# EAGLE schematic Leuchtali_Schematic (EAGLE 6.5.0)
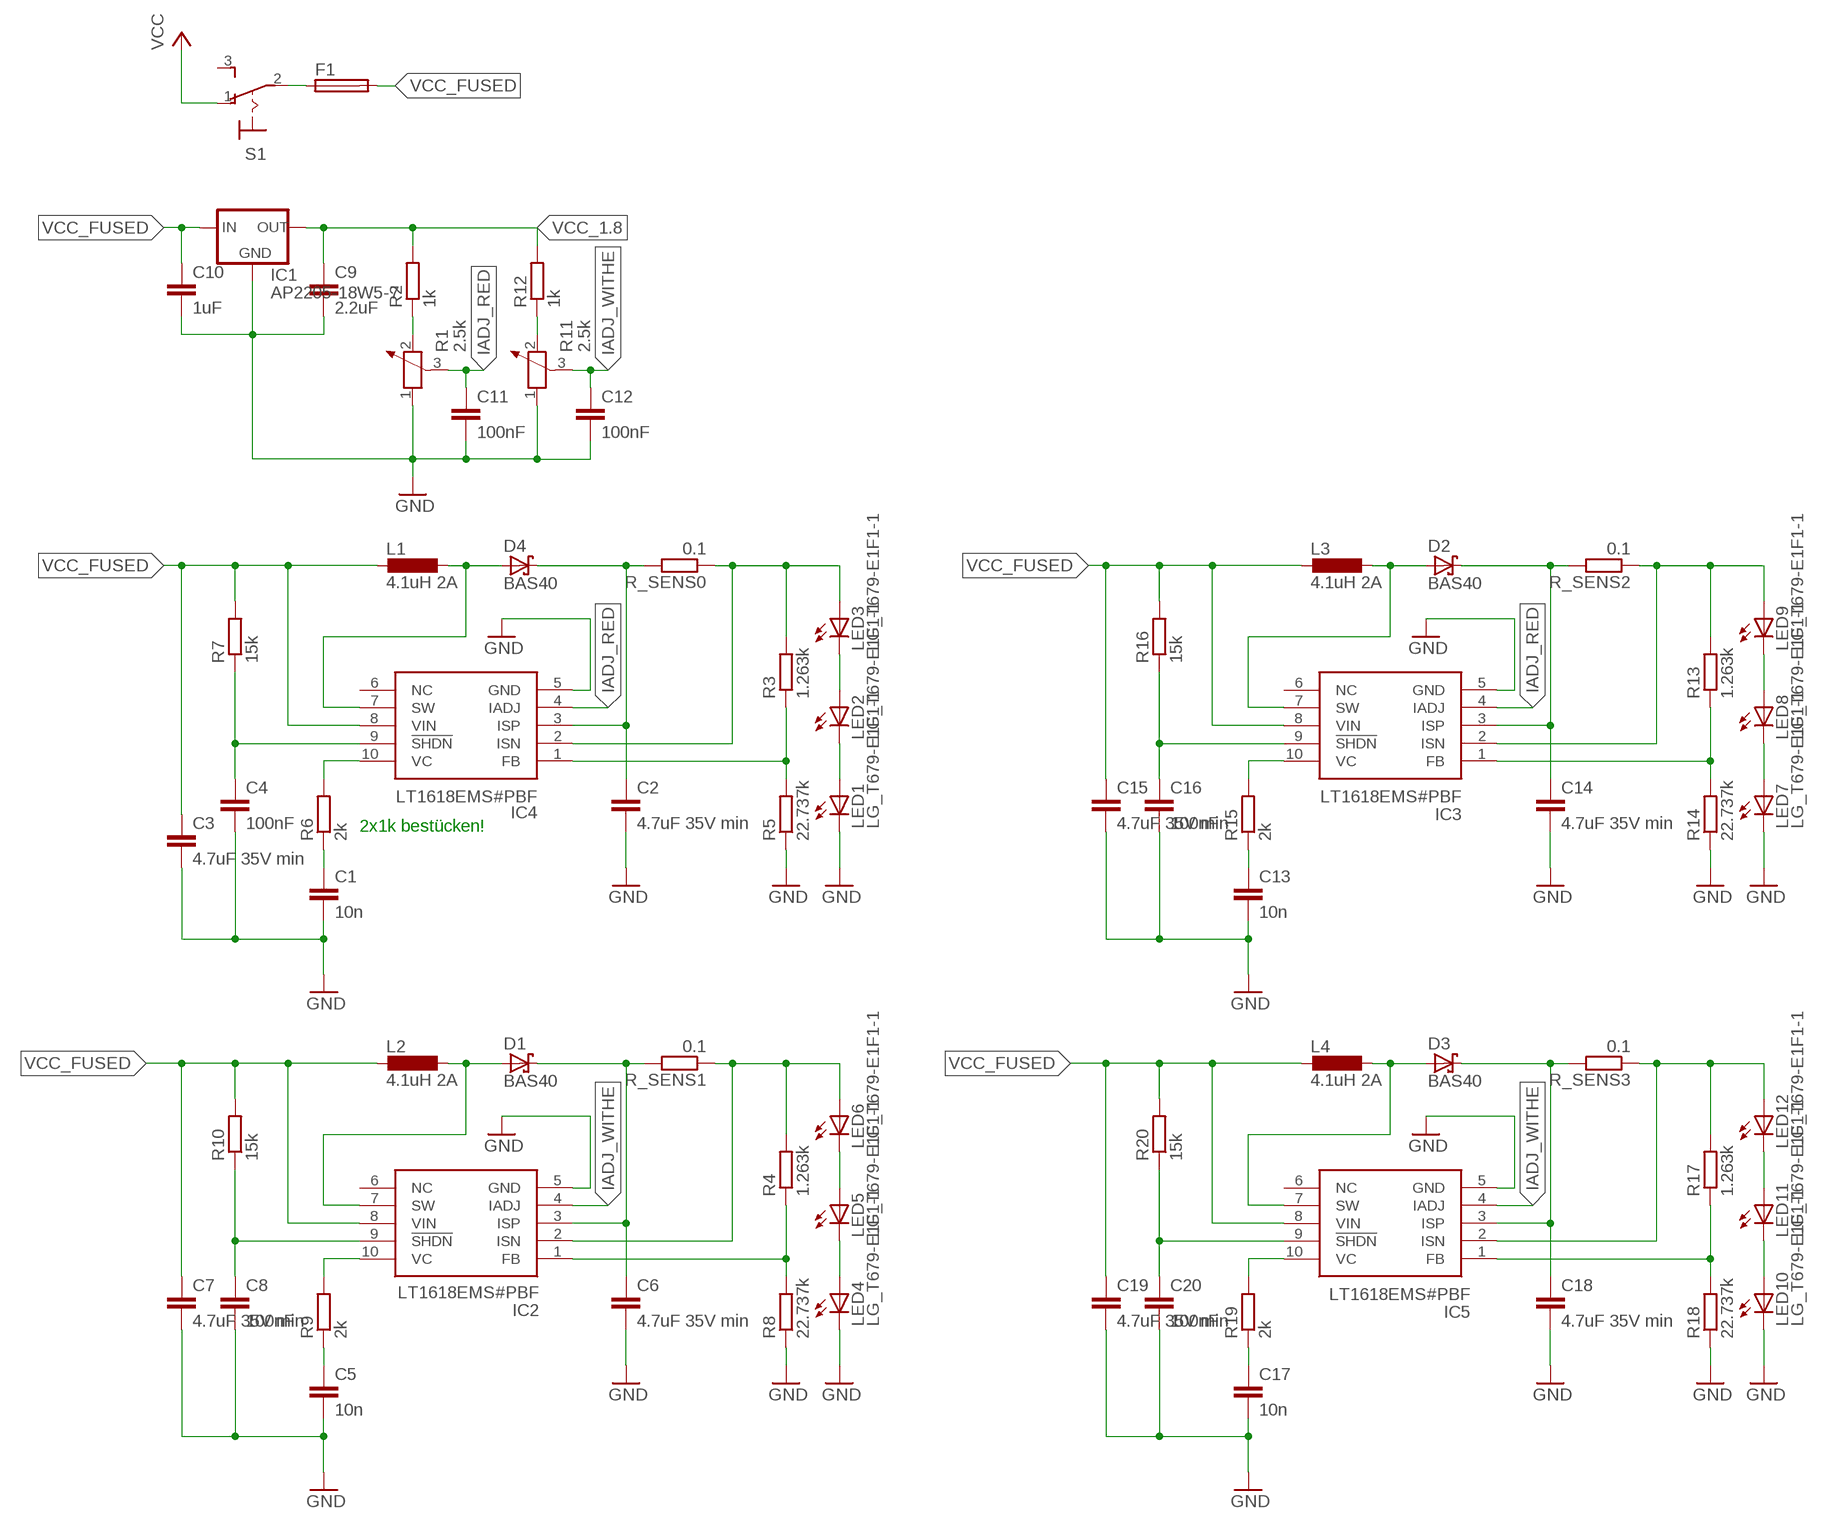
[diagram p0: schematic, sheet 1]

## Parts
C1  10n  C-EUC0805  [C0805]
C2  4.7uF 35V min  C-EUC0805  [C0805]
C3  4.7uF 35V min  C-EUC0805  [C0805]
C4  100nF  C-EUC0805  [C0805]
C5  10n  C-EUC0805  [C0805]
C6  4.7uF 35V min  C-EUC0805  [C0805]
C7  4.7uF 35V min  C-EUC0805  [C0805]
C8  100nF  C-EUC0805  [C0805]
C9  2.2uF  C-EU025-024X044  [C025-024X044]
C10  1uF  C-EU025-024X044  [C025-024X044]
C11  100nF  C-EU025-024X044  [C025-024X044]
C12  100nF  C-EU025-024X044  [C025-024X044]
C13  10n  C-EUC0805  [C0805]
C14  4.7uF 35V min  C-EUC0805  [C0805]
C15  4.7uF 35V min  C-EUC0805  [C0805]
C16  100nF  C-EUC0805  [C0805]
C17  10n  C-EUC0805  [C0805]
C18  4.7uF 35V min  C-EUC0805  [C0805]
C19  4.7uF 35V min  C-EUC0805  [C0805]
C20  100nF  C-EUC0805  [C0805]
D1  BAS40  [SOT23]
D2  BAS40  [SOT23]
D3  BAS40  [SOT23]
D4  BAS40  [SOT23]
F1  GSH15  [GSH15]
IC1  AP2205-18W5-7  78LXX  [78LXX]
IC2  LT1618EMS#PBF  [SOP50P490X110-10N]
IC3  LT1618EMS#PBF  [SOP50P490X110-10N]
IC4  LT1618EMS#PBF  [SOP50P490X110-10N]
IC5  LT1618EMS#PBF  [SOP50P490X110-10N]
L1  4.1uH 2A  L-EU0204/5  [0204/5]
L2  4.1uH 2A  L-EU0204/5  [0204/5]
L3  4.1uH 2A  L-EU0204/5  [0204/5]
L4  4.1uH 2A  L-EU0204/5  [0204/5]
LED1  LG_T679-E1F1-1  [PLCC2]
LED2  LG_T679-E1F1-1  [PLCC2]
LED3  LG_T679-E1F1-1  [PLCC2]
LED4  LG_T679-E1F1-1  [PLCC2]
LED5  LG_T679-E1F1-1  [PLCC2]
LED6  LG_T679-E1F1-1  [PLCC2]
LED7  LG_T679-E1F1-1  [PLCC2]
LED8  LG_T679-E1F1-1  [PLCC2]
LED9  LG_T679-E1F1-1  [PLCC2]
LED10  LG_T679-E1F1-1  [PLCC2]
LED11  LG_T679-E1F1-1  [PLCC2]
LED12  LG_T679-E1F1-1  [PLCC2]
R1  2.5k  POTENTIOMETER_PT-10  [PT-10]
R2  1k  R-EU_R0805  [R0805]
R3  1.263k  R-EU_R0805  [R0805]
R4  1.263k  R-EU_R0805  [R0805]
R5  22.737k  R-EU_R0805  [R0805]
R6  2k  R-EU_R0805  [R0805]
R7  15k  R-EU_R0805  [R0805]
R8  22.737k  R-EU_R0805  [R0805]
R9  2k  R-EU_R0805  [R0805]
R10  15k  R-EU_R0805  [R0805]
R11  2.5k  POTENTIOMETER_PT-10  [PT-10]
R12  1k  R-EU_R0805  [R0805]
R13  1.263k  R-EU_R0805  [R0805]
R14  22.737k  R-EU_R0805  [R0805]
R15  2k  R-EU_R0805  [R0805]
R16  15k  R-EU_R0805  [R0805]
R17  1.263k  R-EU_R0805  [R0805]
R18  22.737k  R-EU_R0805  [R0805]
R19  2k  R-EU_R0805  [R0805]
R20  15k  R-EU_R0805  [R0805]
R_SENS0  0.1  R-EU_R0805  [R0805]
R_SENS1  0.1  R-EU_R0805  [R0805]
R_SENS2  0.1  R-EU_R0805  [R0805]
R_SENS3  0.1  R-EU_R0805  [R0805]
S1  320-916  [320-916]

## Nets
GND: C1.2 C2.2 C3.2 C4.2 C5.2 C6.2 C7.2 C8.2 C9.2 C10.2 C11.2 C12.2 C13.2 C14.2 C15.2 C16.2 C17.2 C18.2 C19.2 C20.2 IC1.GND IC2.5(GND) IC3.5(GND) IC4.5(GND) IC5.5(GND) LED1.C LED4.C LED7.C LED10.C R1.1 R5.1 R8.1 R11.1 R14.1 R18.1
IADJ_RED: C11.1 IC3.4(IADJ) IC4.4(IADJ) R1.3
IADJ_WITHE: C12.1 IC2.4(IADJ) IC5.4(IADJ) R11.3
N$1: R11.2 R12.1
N$2: LED7.A LED8.C
N$3: R1.2 R2.1
N$4: LED8.A LED9.C
N$5: LED4.A LED5.C
N$6: LED5.A LED6.C
N$7: D1.1(A) IC2.7(SW) L2.1
N$8: C6.1 D1.3(C) IC2.3(ISP) R_SENS1.2
N$9: IC2.2(ISN) LED6.A R4.2 R_SENS1.1
N$10: IC2.1(FB) R4.1 R8.2
N$11: IC2.10(VC) R9.2
N$12: C5.1 R9.1
N$13: LED1.A LED2.C
N$14: LED2.A LED3.C
N$15: D4.1(A) IC4.7(SW) L1.1
N$16: C4.1 IC4.9(!SHDN) R7.1
N$17: C2.1 D4.3(C) IC4.3(ISP) R_SENS0.2
N$18: IC4.2(ISN) LED3.A R3.2 R_SENS0.1
N$19: IC4.1(FB) R3.1 R5.2
N$20: IC4.10(VC) R6.2
N$21: C1.1 R6.1
N$22: D2.1(A) IC3.7(SW) L3.1
N$23: C8.1 IC2.9(!SHDN) R10.1
N$24: F1.1 S1.2(P)
N$25: C14.1 D2.3(C) IC3.3(ISP) R_SENS2.2
N$26: IC3.2(ISN) LED9.A R13.2 R_SENS2.1
N$27: IC3.1(FB) R13.1 R14.2
N$28: IC3.10(VC) R15.2
N$29: C13.1 R15.1
N$30: C16.1 IC3.9(!SHDN) R16.1
N$31: LED10.A LED11.C
N$32: LED11.A LED12.C
N$33: D3.1(A) IC5.7(SW) L4.1
N$34: C18.1 D3.3(C) IC5.3(ISP) R_SENS3.2
N$35: IC5.2(ISN) LED12.A R17.2 R_SENS3.1
N$36: IC5.1(FB) R17.1 R18.2
N$37: IC5.10(VC) R19.2
N$38: C17.1 R19.1
N$39: C20.1 IC5.9(!SHDN) R20.1
VCC: S1.1(O)
VCC_1.8: C9.1 IC1.OUT R2.2 R12.2
VCC_FUSED: C3.1 C7.1 C10.1 C15.1 C19.1 F1.2 IC1.IN IC2.8(VIN) IC3.8(VIN) IC4.8(VIN) IC5.8(VIN) L1.2 L2.2 L3.2 L4.2 R7.2 R10.2 R16.2 R20.2
Unconnected: IC2.6(NC) IC3.6(NC) IC4.6(NC) IC5.6(NC) S1.3(S)

## Notes on the sheet
- 2x1k bestücken!

## Library data of the parts
C1-C20 = rcl:C-EU: CAPACITOR, European symbol
D1-D4 = diode:BAS40: Silicon Schottky Diodes General-purpose diode for high-speed switching
F1 = fuse:GSH15: FUSE HOLDER grid 15mm, 19649 Wickmann; MPN: 64900001039; OC_FARNELL: 1271673; OC_NEWARK: 02P0318
IC1 = v-reg:78LXX: VOLTAGE REGULATOR
IC2-IC5 = LT1618EMS:LT1618EMS#PBF: Linear Technology LT1618EMS#PBF, Step Up DC-DC Converter, Maximum of 35 V 10-Pin, MSOP Source: Datasheet <https://www.analog.com/media/en/technical-documentation/data-sheets/1618fas.pdf>; DESCRIPTION: Linear Technology LT1618EMS#PBF, Step Up DC-DC Converter, Maximum of 35 V 10-Pin, MSOP; HEIGHT: 1.1mm; MANUFACTURER_NAME: Linear Technology; MANUFACTURER_PART_NUMBER: LT1618EMS#PBF; MOUSER_PART_NUMBER: 584-LT1618EMS#PBF; MOUSER_PRICE-STOCK: https://www.mouser.co.uk/ProductDetail/Analog-Devices-Linear-Technology/LT1618EMSPBF?qs=ytflclh7QUXSkJbF7xtAZg%3D%3D
L1-L4 = rcl:L-EU: INDUCTOR, European symbol
LED1-LED12 = led:*_T679-?-1: LC TOPLED® Low Current LED Source: http://catalog.osram-os.com .. LG_LS_LY_T679_OBS.pdf; COLOR: green
R1 R11 = rcl:POTENTIOMETER_: Potentiometer
R2-R10 R12-R20 R_SENS0 R_SENS1-R_SENS3 = rcl:R-EU_: RESISTOR, European symbol
S1 = switch:320-916: TOGGLE SWITCH distributor RS Components